# Altium schematic sheet Delta.SchDoc
size A4; SheetNumber: 2; SheetTotal: 4
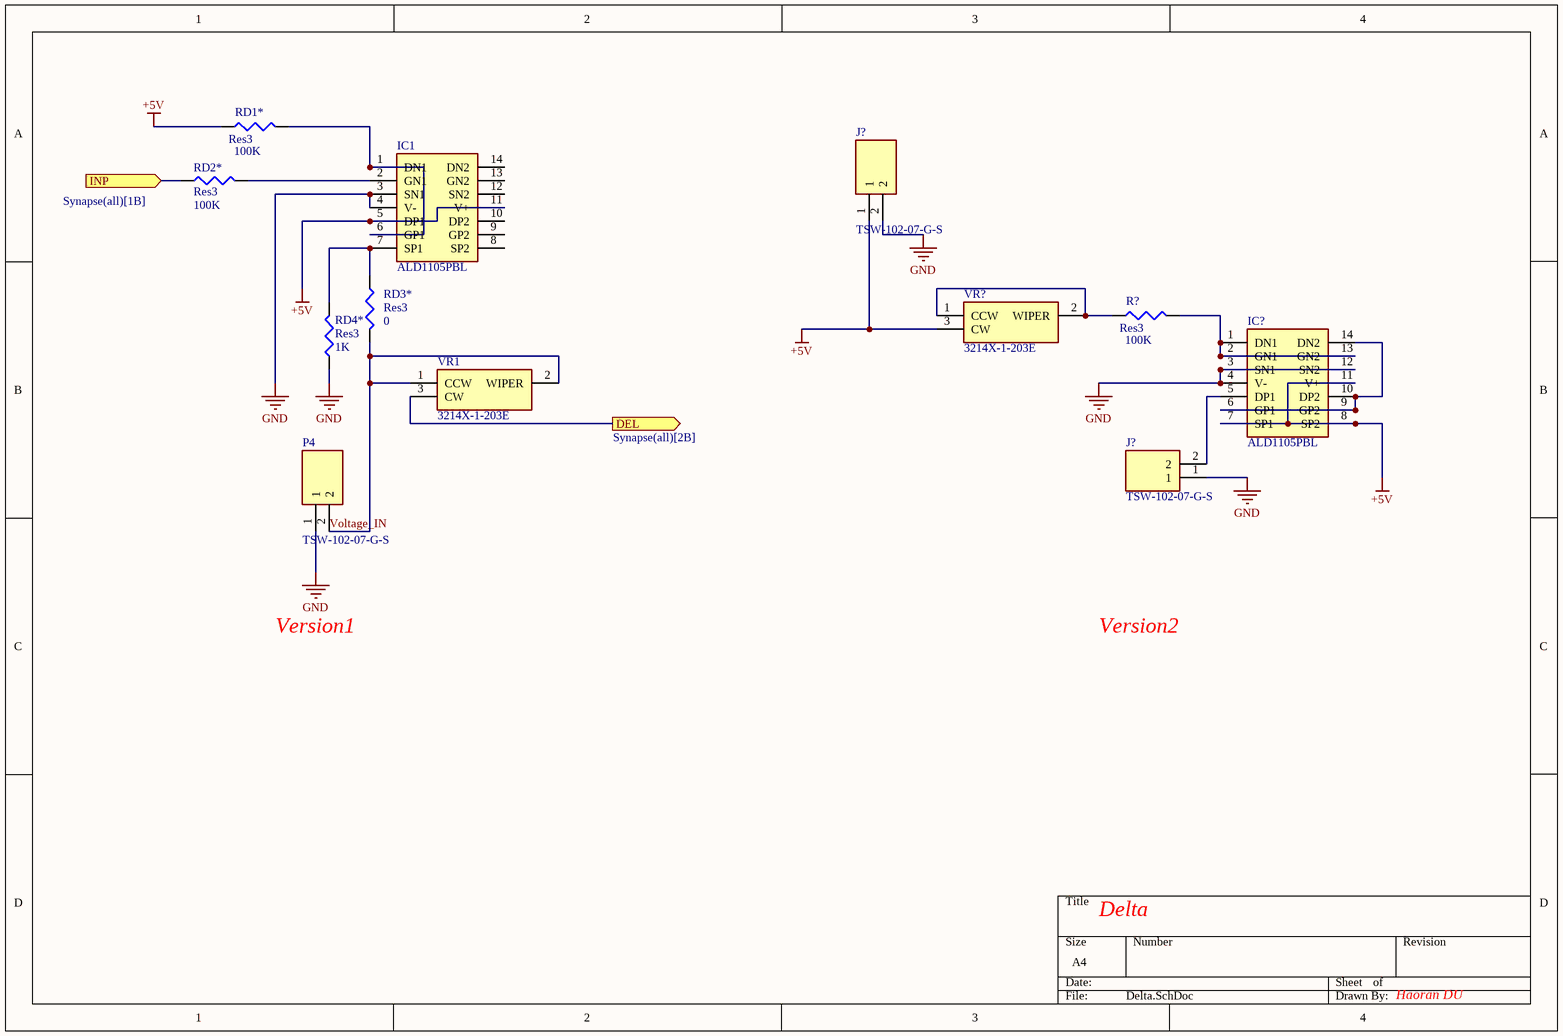
[diagram p0: Delta.SchDoc]

## Parts
(Parts that share a designator on the sheet are numbered #1, #2 ... from top to bottom, then left to right.)
IC1  ALD1105PBL  [DIP762W51P254L1828H508Q14N]
IC?  ALD1105PBL  [DIP762W51P254L1828H508Q14N]
J?#1  TSW-102-07-G-S  [TSW-102-XX-YY-S]
J?#2  TSW-102-07-G-S  [TSW-102-XX-YY-S]
P4  TSW-102-07-G-S  [TSW-102-XX-YY-S]
R?  Res3  value 100K  [J1-0603]
RD1*  Res3  value 100K  [J1-0603]
RD2*  Res3  value 100K  [J1-0603]
RD3*  Res3  value 0  [J1-0603]
RD4*  Res3  value 1K  [J1-0603]
VR1  3214X-1-203E  [3214X1203E]
VR?  3214X-1-203E  [3214X1203E]

## Ports
DEL (out, see Synapse(all)[2B]), INP (in, see Synapse(all)[1B])

## Nets
+5V: IC1.5(DP1) IC1.11(V+) IC?.7(SP1) IC?.8(SP2) IC?.11(V+) J?#1.1 RD1*.1 VR?.3(CW)
GND: IC1.3(SN1) IC1.4(V-) IC?.3(SN1) IC?.4(V-) IC?.12(SN2) J?#1.2 J?#2.1 P4.1 RD4*.1
DEL: VR1.3(CW) ; port DEL
INP: RD2*.1 ; port INP
Voltage_IN: P4.2 RD3*.2 VR1.1(CCW) VR1.2(WIPER)
NetIC1_1: IC1.1(DN1) IC1.6(GP1) RD1*.2
NetIC1_2: IC1.2(GN1) RD2*.2
NetIC1_7: IC1.7(SP1) RD3*.1 RD4*.2
NetIC?_1: IC?.1(DN1) IC?.2(GN1) IC?.13(GN2) R?.2
NetIC?_5: IC?.5(DP1) J?#2.2
NetIC?_6: IC?.6(GP1) IC?.9(GP2) IC?.10(DP2) IC?.14(DN2)
NetR?_1: R?.1 VR?.1(CCW) VR?.2(WIPER)

Not connected (* = marked no-connect by the designer): IC1 8(SP2) 9(GP2) 10(DP2) 12(SN2) 13(GN2) 14(DN2)

## Notes on the sheet
- Version1
- Version2
- Delta
- Haoran DU

## Library data of the parts
IC1 IC? = ALD1105PBL: Integrated Circuit; Manufacturer_Name: Advanced Linear Devices Inc.; Datasheet Link: https://www.mouser.es/datasheet/2/8/ALD1105-963896.pdf; Height: 5.08mm; Manufacturer_Part_Number: ALD1105PBL; Mouser Part Number: 585-ALD1105PBL; Mouser Price/Stock: https://www.mouser.co.uk/ProductDetail/Advanced-Linear-Devices/ALD1105PBL?qs=Du6x3Vjr3lUq%2FSLBVb98Ng%3D%3D
J?#1 J?#2 P4 = TSW-102-07-G-S: Connector; Manufacturer_Name: SAMTEC; Datasheet Link: http://suddendocs.samtec.com/prints/tsw-xxx-xx-xxx-x-xx-xxx-mkt.pdf; Manufacturer_Part_Number: TSW-102-07-G-S; Mouser Part Number: 200-TSW10207GS; Mouser Price/Stock: https://www.mouser.co.uk/ProductDetail/Samtec/TSW-102-07-G-S?qs=iT52DjcXudsNPhlNCDp8vw%3D%3D; Arrow Part Number: TSW-102-07-G-S; Arrow Price/Stock: https://www.arrow.com/en/products/tsw-102-07-g-s/samtec?region=europe
R? RD1* RD2* RD3* RD4* = Res3: Resistor; Published: 8-Jun-2000; LatestRevisionDate: 29-May-2009; LatestRevisionNote: IPC-7351 Footprint Added.; PackageReference: J1-0603; Publisher: Altium Limited; PackageDescription: Chip Resistor
VR1 VR? = 3214X-1-203E: Variable Resistor; Manufacturer_Name: Bourns; Datasheet Link: https://www.bourns.com/pdfs/3214.pdf; Height: 5.3mm; Manufacturer_Part_Number: 3214X-1-203E; Mouser Part Number: 652-3214X-1-203E; Mouser Price/Stock: https://www.mouser.co.uk/ProductDetail/Bourns/3214X-1-203E?qs=GbiU%252BivmtKCiZgVfjOTq7A%3D%3D; Arrow Part Number: 3214X-1-203E; Arrow Price/Stock: https://www.arrow.com/en/products/3214x-1-203e/bourns?region=nac